# EAGLE design base-1u-triacs (EAGLE 4.16)
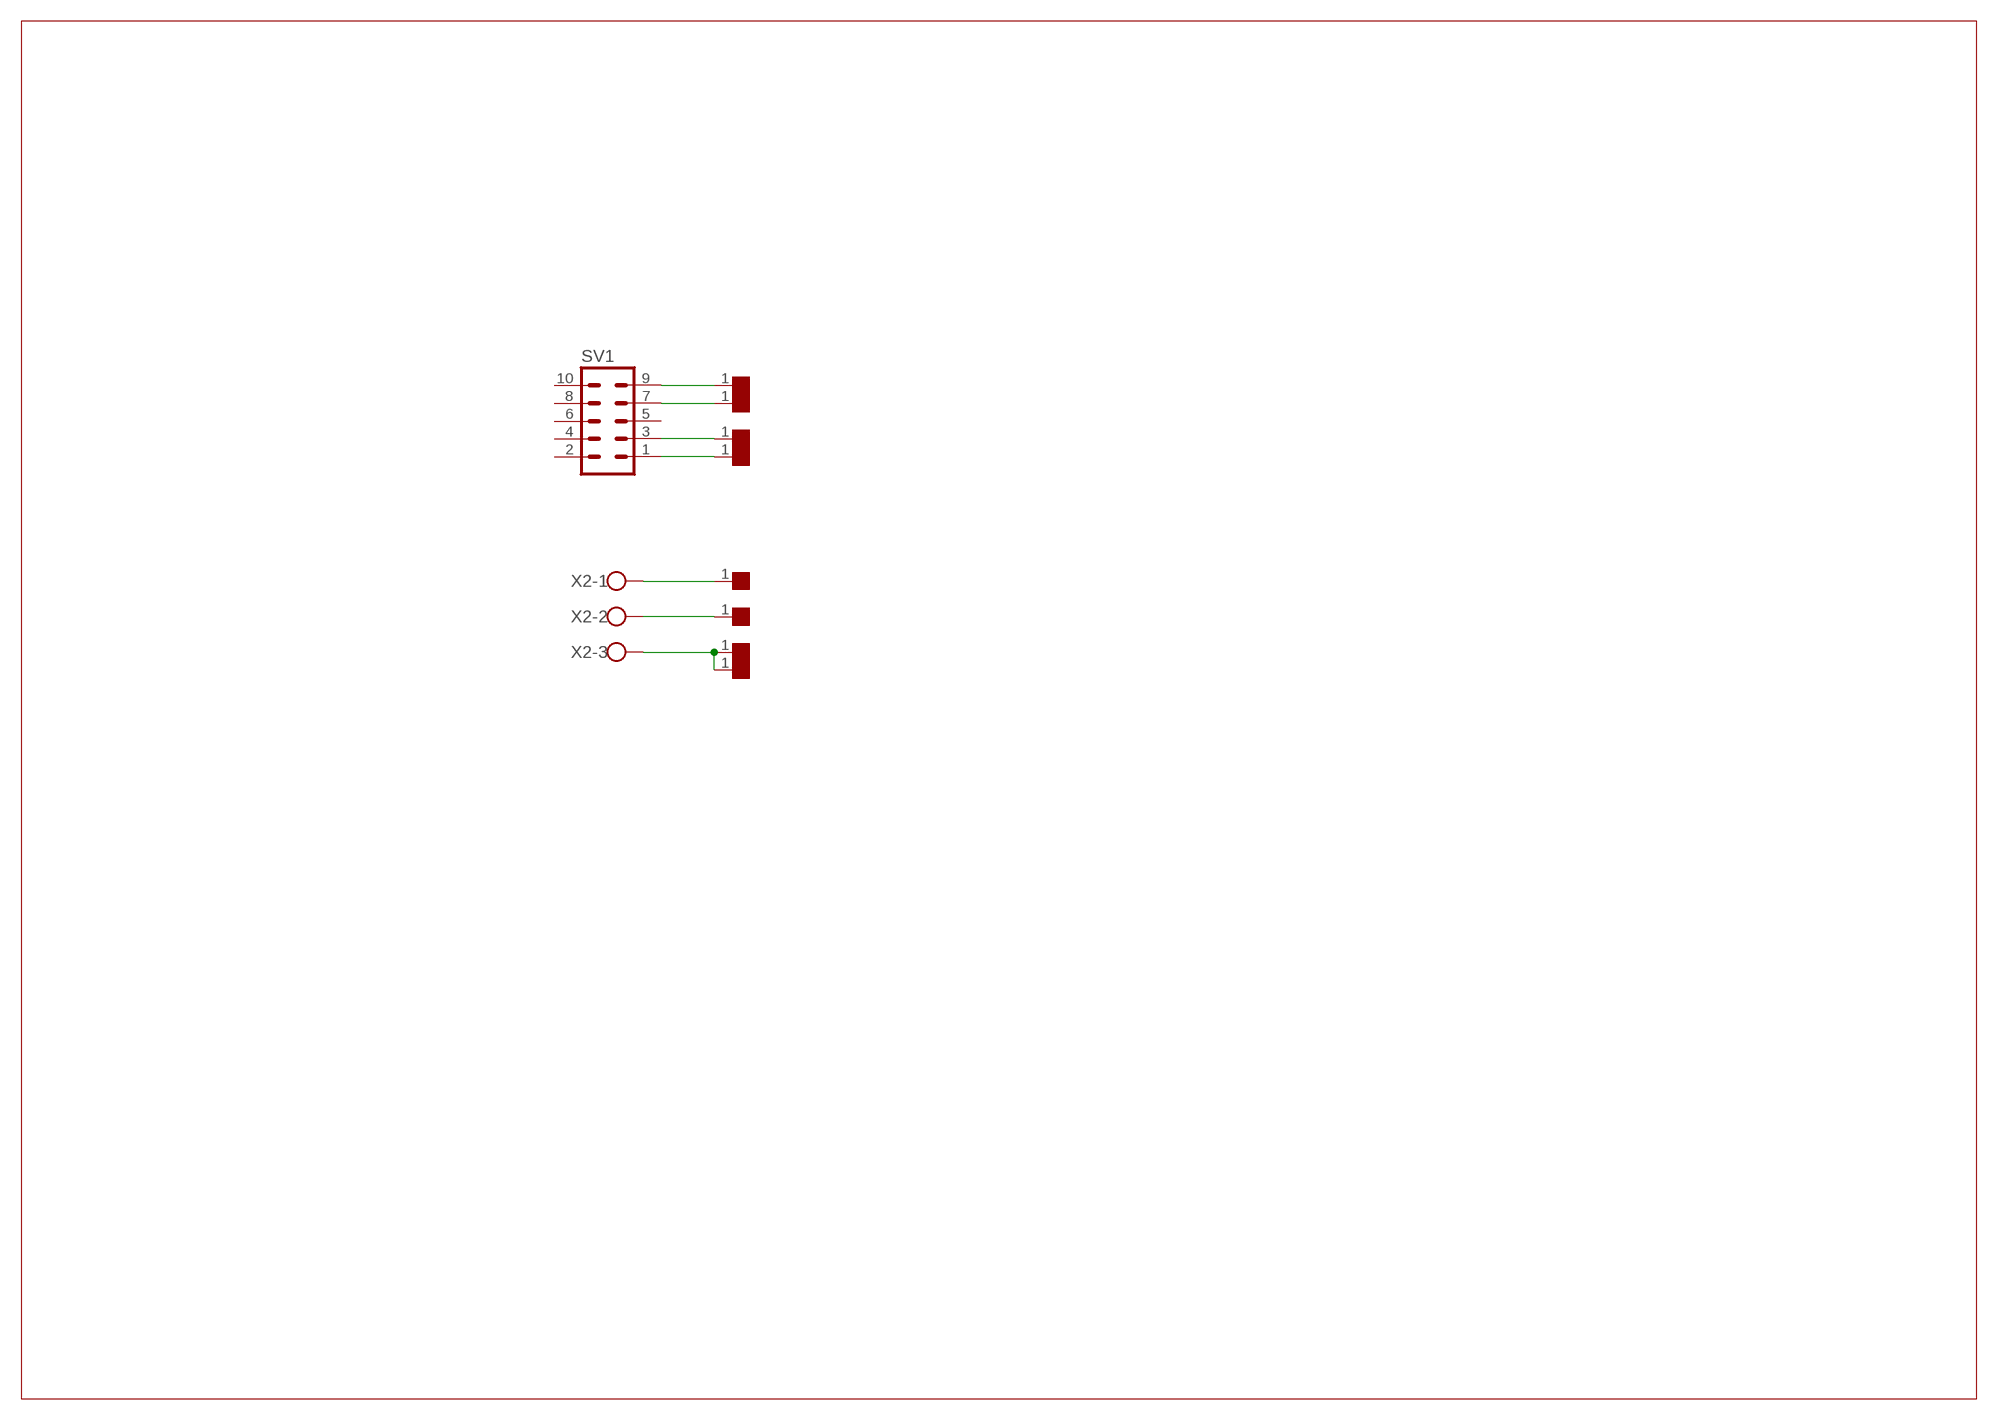
[diagram p0: schematic, sheet 1]

## Parts
SV1  MA05-2  [MA05-2]
T1  TESTPOINT  [TESTPOIN]
T2  TESTPOINT  [TESTPOIN]
T3  TESTPOINT  [TESTPOIN]
T4  TESTPOINT  [TESTPOIN]
T5  TESTPOINT  [TESTPOIN]
T6  TESTPOINT  [TESTPOIN]
T7  TESTPOINT  [TESTPOIN]
T8  TESTPOINT  [TESTPOIN]
X2  W237-103  [W237-103]

## Nets
N$6: SV1.9 T3.1
N$7: SV1.7 T4.1
N$8: SV1.3 T2.1
N$9: SV1.1 T1.1
N$10: T5.1 X2.1
N$11: T6.1 X2.2
N$12: T7.1 T8.1 X2.3
Unconnected: SV1.2 SV1.4 SV1.5 SV1.6 SV1.8 SV1.10

## Library data of the parts
SV1 = con-lstb:MA05-2: PIN HEADER
T1-T8 = ADS:TESTPOINT
X2 = con-wago-500:W237-103: WAGO SCREW CLAMP

## Board
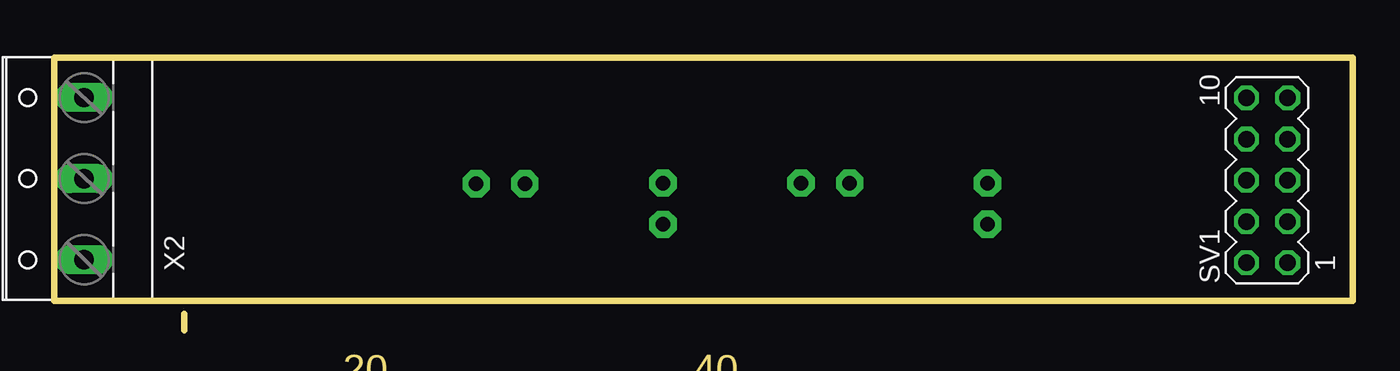
[diagram p1: board, top side]
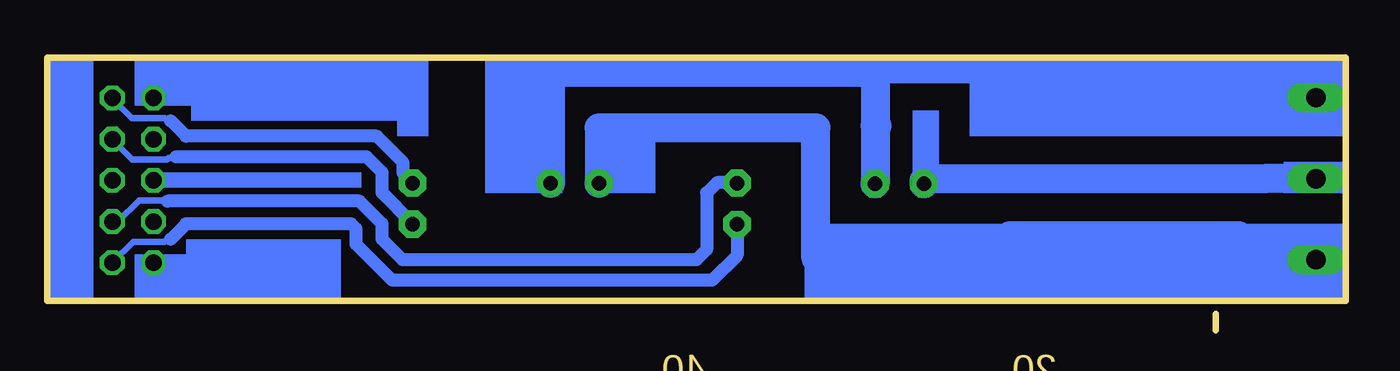
[diagram p2: board, bottom side, seen from below]

Size 80 x 16.8 mm. Coordinates in mm from the lower left corner, seen from the top.
Outline: 8,1 8,0
Outline: 0,1.8 80,1.8 80,16.8 0,16.8 0,1.8
Copper layers (1*16): Top 0.035mm / dielectric 1.5mm / Bottom 0.035mm
Design rules "default": minimum track width 10mil, minimum drill 24mil, track to track 8mil, track to pad 8mil, pad to pad 8mil, via to via 8mil, smd to smd 8mil, copper to edge 40mil, drill to drill 8mil, minimum pad ring 10mil, minimum via ring 8mil, stop-mask expansion 4mil, vias tented up to drill 0mil, thermal gap 10mil

### Footprints (pad centres in the part's own frame; a part is rotated, then mirrored left to right if it is on the bottom)
MA05-2 = drill 1.016 octagon: 1 -5.08,-1.27; 2 -5.08,1.27; 3 -2.54,-1.27; 4 -2.54,1.27; 5 0,-1.27; 6 0,1.27; 7 2.54,-1.27; 8 2.54,1.27; 9 5.08,-1.27; 10 5.08,1.27
TESTPOIN = drill 0.889 pad 1.676 octagon: 1 0,0
W237-103 = drill 1.194 long: 1 -5,-1.29; 2 0,-1.29; 3 5,-1.29

### Placement (x,y rotation side)
SV1  74.72,9.24 90 top
T1  37.5,6.53 0 top
T2  37.51,9.07 0 top
T3  57.5,9.07 0 top
T4  57.5,6.53 0 top
T5  46,9.07 0 top
T6  26,9.03 0 top
T7  29,9.03 0 top
T8  49,9.07 0 top
X2  0.56,9.35 90 top

### Tracks (layer width: path | path; a pad name or v marks a point on that pad's centre or on a via)
N$1
  Bottom 0.406: 0,2.75 0,1.8 0.95,1.8
N$2
  Bottom 0.406: 0,16.72 0,15.77
N$3
  Bottom 0.406: 0.93,16.8 0,16.8
N$4
  Bottom 0.406: 79.17,16.8 80,16.8 80,16.16
N$5
  Bottom 0.406: 80,2.48 80,1.8 79.01,1.8
N$6
  Bottom 0.406: 72.39,12.91 72.59,12.91 72.76,13.08 74.8,13.08 76.01,14.29 SV1.9
  Bottom 0.813: 72.39,12.91 71.44,11.96 59.69,11.96 58.07,10.34 58.07,9.7 57.47,9.1 T3.1
N$7
  Bottom 0.406: 72.07,10.69 72.35,10.69 72.43,10.61 72.52,10.61 72.62,10.51 74.75,10.51 75.99,11.75 SV1.7
  Bottom 0.813: T4.1 57.5,6.59 59.37,8.47 59.37,9.74 60.33,10.69 72.07,10.69
N$8
  Bottom 0.406: SV1.3 75.64,6.7 74.33,8.01 72.63,8.01 72.58,7.96
  Bottom 0.813: 72.58,7.96 60.77,7.96 59.37,6.56 59.37,5.61 58.1,4.34 40.01,4.34 39.37,4.97 39.37,8.47 38.73,9.1 37.47,9.1 37.49,9.07 T2.1
N$9
  Bottom 0.406: 72.39,5.61 72.62,5.61 72.78,5.45 74.71,5.45 SV1.1
  Bottom 0.813: T1.1 37.5,4.62 39.05,3.07 58.74,3.07 60.96,5.29 60.96,6.25 61.28,6.56 71.44,6.56 72.39,5.61
N$10
  Bottom 1.778: T5.1 46,12.47 46.01,12.48 32.65,12.48 32.65,4.44 32.57,4.36 22.16,4.36 20.7,5.82 6.61,5.82 5.08,4.29 5.03,4.34 X2.1
N$11
  Bottom 1.778: T6.1 26,9.22 25.89,9.33 4.97,9.33 4.99,9.35 X2.2
N$12
  Bottom 1.778: T8.1 49,15.88 28.99,15.88 28.99,15.77 | T7.1 28.99,12.6 | 28.99,15.77 28.99,12.6 | X2.3 5.24,14.35 5.24,15.93 5.08,16.09 28.57,16.09 28.89,15.77 28.99,15.77 | 28.99,12.6 28.89,12.6
(copper drawn outside any net)
  shapes: Bottom area x14

### Text on the board
Dimension: 20 | 40
tOrigins: +1.27 | 4.77 | 3.5 | 60 | -1.27 | -32.53 | -21.27 | -12.53 | 47.47 | 58.73 | 27.47 | 38.73